# Altium schematic sheet CAN.SchDoc
size A
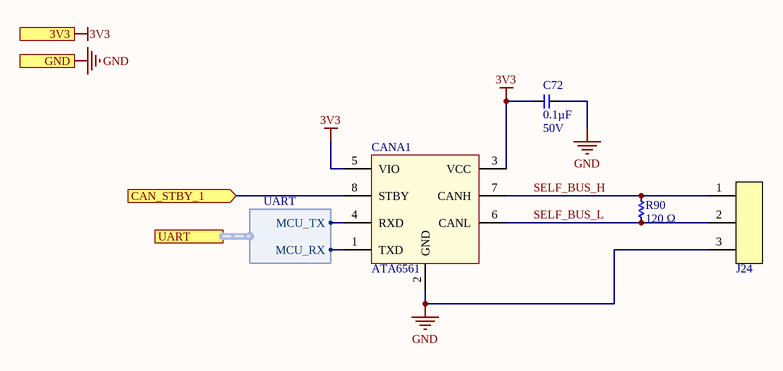
[diagram p0: CAN.SchDoc]

## Parts
C72  Capacitance (shorthand): 0.1µF  Rated Voltage: 50V  [C0603]  (hidden comment: 490-1519-1-ND)
CANA1  ATA6561  [8SOIC150]
J24  CONN_1x3  [CONN_1x3_100MIL]  (value not drawn)
R90  Resistance: 120 Ω  [R0603]  (hidden comment: 311-120HRCT-ND)

## Ports
3V3 (in), CAN_STBY_1 (in), GND (in), UART (harness UART)

## Harnesses
UART: MCU_RX, MCU_TX

## Nets
3V3: C72.2 CANA1.3(VCC) CANA1.5(VIO) ; port 3V3
GND: C72.1 CANA1.2(GND) J24.3 ; port GND
CAN_STBY_1: CANA1.8(STBY) ; port CAN_STBY_1
SELF_BUS_H: CANA1.7(CANH) J24.1 R90.2
SELF_BUS_L: CANA1.6(CANL) J24.2 R90.1
NetCANA1_1: CANA1.1(TXD) ; port UART.MCU_RX
NetCANA1_4: CANA1.4(RXD) ; port UART.MCU_TX

## Library data of the parts
C72 = CMP-119-0065-1: CAP CER 0603 0.1µF X7R 50V 10%; Manufacturer: Murata Electronics North America; Capacitance - pF (Machine readable): #NAME?; Dielectric: X7R
CANA1 = CMP-041-0000-1: Atmel CAN Bus Transciever; Design Item ID: ATA6561; Source: ic_data_converters.SchLib
J24 = CMP-029-0002-1: CONN HEADER 3POS T/H; Manufacturer Part Number: 61300311121; Manufacturer: Wurth Electronics; Gender: Male; Number of Contacts: 3; Connector Type: Male Pin; Pitch: 0.1inch; Pricing 1: 1=0.13, 10=0.106, 25=0.088, 50=0.074, 100=0.067, 1000=0.061 (USD); Design Item ID: CONN_1x3; REACH SVHC: Unknown; Mount: Through Hole; Color: Black; Contact Mating Length: 0.236inch; Number of Positions: 3; Termination: Solder; Source: connector.SchLib; Number of Rows: 1; Packaging: Bulk; Contact Plating: Gold; Lead Free: Lead Free; Stock 1: 146989; Contact Material: Copper
R90 = CMP-126-0077-2: RES SMD 120 OHM 1% 1/10W 0603; Manufacturer Part Number: RC0603FR-07120RL; Manufacturer: Yageo; Resistance (Sortable): 120; Power (Watts): 0.1W, 1/10W; Temperature Coefficient: ±100ppm/°C; Datasheets: http://www.yageo.com/documents/recent/PYu-RC_Group_51_RoHS_L_9.pdf; Image: //media.digikey.com/Renders/Yageo%20Renders/0603-(1608-Metric).jpg; Tolerance: ±1%; Operating Temperature: -55°C ~ 155°C